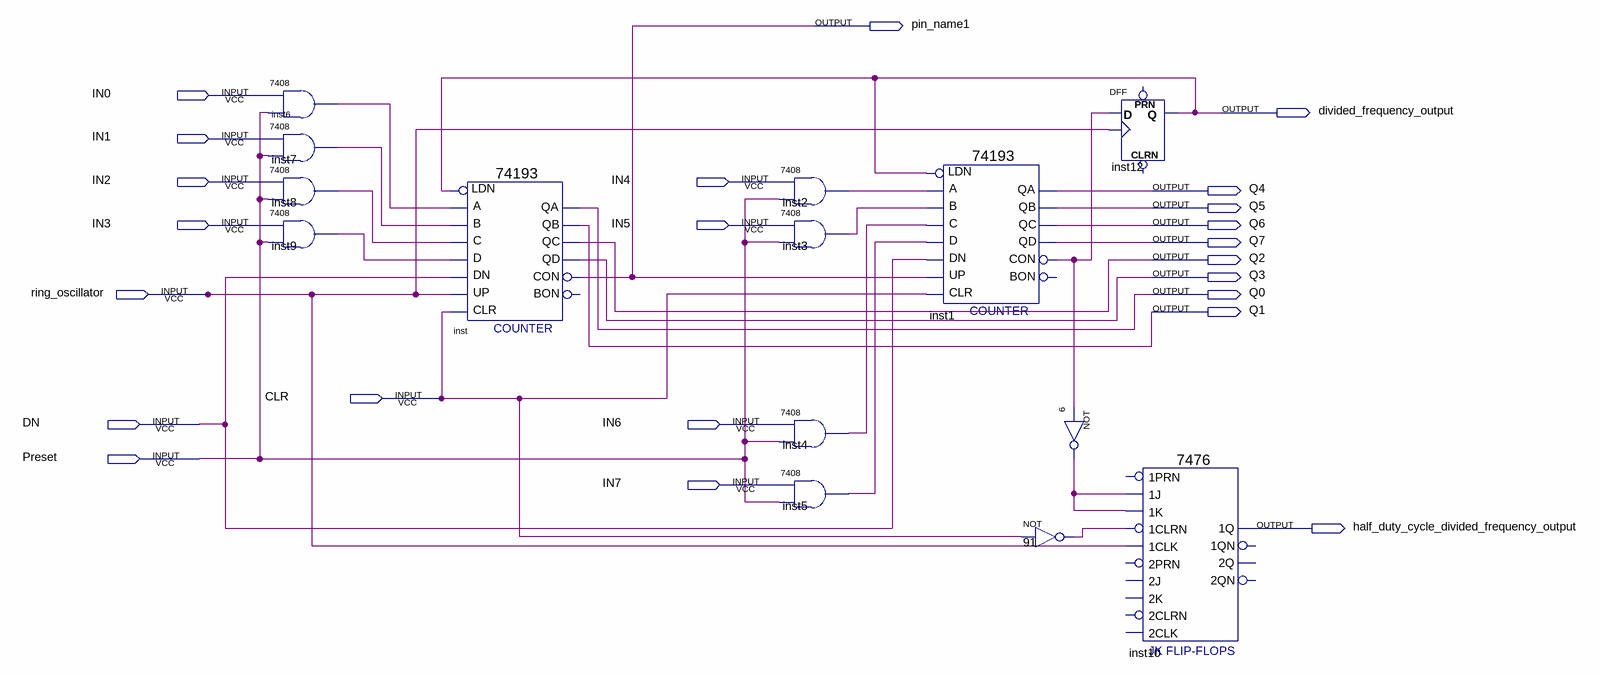
[diagram p0: schematic sheet]
// Quartus schematic Frequency_Divider.bdf as structural Verilog: 14 symbols, 23 pins
module Frequency_Divider (
  input  IN0,
  input  IN1,
  input  IN2,
  input  IN4,
  input  IN3,
  input  IN5,
  input  ring_oscillator,
  input  CLR,
  input  DN,
  input  IN6,
  input  Preset,
  input  IN7,
  output pin_name1,
  output divided_frequency_output,
  output Q4,
  output Q5,
  output Q6,
  output Q7,
  output Q2,
  output Q3,
  output Q0,
  output Q1,
  output half_duty_cycle_divided_frequency_output
);

  wire inst1_con, inst2_1, inst3_1, inst4_1, inst5_1, inst6_1, inst7_1, inst8_1, inst9_1, n6_out, n91_out;

  \7408  inst6 (.\3 (Preset), .\2 (IN0), .\1 (inst6_1));
  \7408  inst7 (.\3 (Preset), .\2 (IN1), .\1 (inst7_1));
  \7408  inst8 (.\3 (Preset), .\2 (IN2), .\1 (inst8_1));
  \7408  inst9 (.\3 (Preset), .\2 (IN3), .\1 (inst9_1));
  \74193  inst (
    .D(inst9_1), .C(inst8_1), .B(inst7_1), .A(inst6_1), .CLR(CLR), .UP(ring_oscillator), .DN(DN),
    .LDN(divided_frequency_output), .QB(Q1), .QA(Q0), .CON(pin_name1), .QD(Q3), .QC(Q2));  // open: BON
  \7408  inst2 (.\3 (Preset), .\2 (IN4), .\1 (inst2_1));
  \7408  inst3 (.\3 (Preset), .\1 (inst3_1));  // open: 2
  \7408  inst4 (.\3 (Preset), .\2 (IN6), .\1 (inst4_1));
  \7408  inst5 (.\3 (Preset), .\2 (IN7), .\1 (inst5_1));
  \74193  inst1 (
    .D(inst5_1), .C(inst4_1), .B(inst3_1), .A(inst2_1), .CLR(CLR), .UP(pin_name1), .DN(DN),
    .LDN(divided_frequency_output), .QB(Q5), .QA(Q4), .CON(inst1_con), .QD(Q7), .QC(Q6));  // open: BON
  not u_6 (n6_out, inst1_con);
  not u_91 (n91_out, CLR);
  DFF inst12 (.CLK(ring_oscillator), .D(inst1_con), .Q(divided_frequency_output));  // open: CLRN, PRN
  \7476  inst10 (
    .\1J (n6_out), .\1K (n6_out), .\1CLK (ring_oscillator), .\1CLRN (n91_out),
    .\1Q (half_duty_cycle_divided_frequency_output));  // open: 1PRN, 2PRN, 2J, 2K, 2CLRN, 2CLK, 2QN, 2Q, 1QN
endmodule
